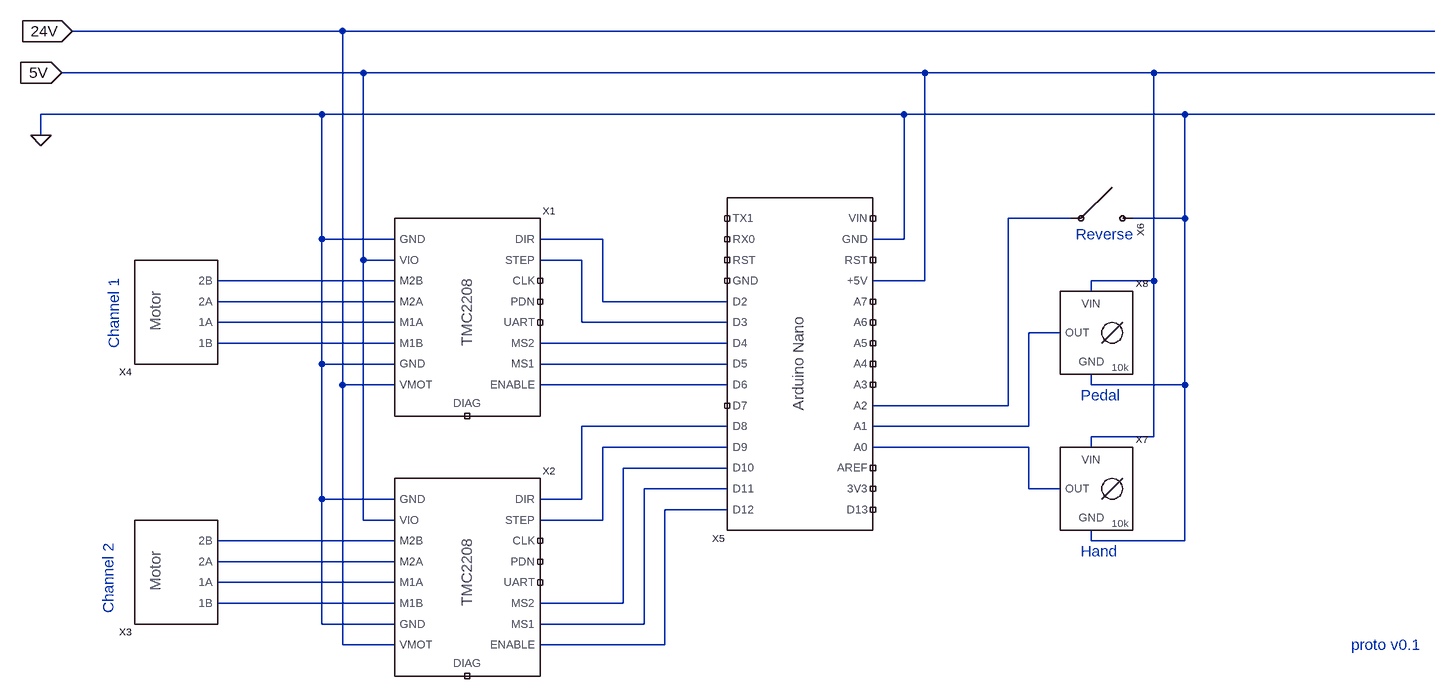
[diagram p0: schematic dual_stepper.asc]
dual_stepper.asc, the LTspice schematic file:
Version 4
SHEET 1 1844 740
WIRE -304 -384 -720 -384
WIRE 1376 -384 -304 -384
WIRE -272 -320 -736 -320
WIRE 592 -320 -272 -320
WIRE 944 -320 592 -320
WIRE 1376 -320 944 -320
WIRE -336 -256 -768 -256
WIRE 560 -256 -336 -256
WIRE 992 -256 560 -256
WIRE 1376 -256 992 -256
WIRE -768 -224 -768 -256
WIRE 816 -96 720 -96
WIRE 992 -96 992 -256
WIRE 992 -96 912 -96
WIRE -336 -64 -336 -256
WIRE -224 -64 -336 -64
WIRE 96 -64 0 -64
WIRE 560 -64 560 -256
WIRE 560 -64 512 -64
WIRE -272 -32 -272 -320
WIRE -224 -32 -272 -32
WIRE 64 -32 0 -32
WIRE -224 0 -496 0
WIRE 592 0 592 -320
WIRE 592 0 512 0
WIRE 944 0 944 -320
WIRE 944 0 848 0
WIRE 848 16 848 0
WIRE -224 32 -496 32
WIRE 96 32 96 -64
WIRE 288 32 96 32
WIRE -224 64 -496 64
WIRE 64 64 64 -32
WIRE 288 64 64 64
WIRE 800 80 752 80
WIRE -224 96 -496 96
WIRE 288 96 0 96
WIRE -336 128 -336 -64
WIRE -224 128 -336 128
WIRE 288 128 0 128
WIRE -304 160 -304 -384
WIRE -224 160 -304 160
WIRE 288 160 0 160
WIRE 848 160 848 144
WIRE 992 160 992 -96
WIRE 992 160 848 160
WIRE 720 192 720 -96
WIRE 720 192 512 192
WIRE 288 224 64 224
WIRE 752 224 752 80
WIRE 752 224 512 224
WIRE 944 240 944 0
WIRE 944 240 848 240
WIRE 288 256 96 256
WIRE 752 256 512 256
WIRE 848 256 848 240
WIRE 288 288 128 288
WIRE 288 320 160 320
WIRE 752 320 752 256
WIRE 800 320 752 320
WIRE -336 336 -336 128
WIRE -224 336 -336 336
WIRE 64 336 64 224
WIRE 64 336 0 336
WIRE 288 352 192 352
WIRE -272 368 -272 -32
WIRE -224 368 -272 368
WIRE 96 368 96 256
WIRE 96 368 0 368
WIRE -224 400 -496 400
WIRE 848 400 848 384
WIRE 992 400 992 160
WIRE 992 400 848 400
WIRE -224 432 -496 432
WIRE -224 464 -496 464
WIRE -224 496 -496 496
WIRE 128 496 128 288
WIRE 128 496 0 496
WIRE -336 528 -336 336
WIRE -224 528 -336 528
WIRE 160 528 160 320
WIRE 160 528 0 528
WIRE -304 560 -304 160
WIRE -224 560 -304 560
WIRE 192 560 192 352
WIRE 192 560 0 560
FLAG -768 -224 0
FLAG -720 -384 24V
IOPIN -720 -384 In
FLAG -736 -320 5V
IOPIN -736 -320 In
SYMBOL TMC2208 -240 -80 R0
SYMATTR InstName X1
SYMBOL TMC2208 -240 320 R0
SYMATTR InstName X2
SYMBOL motor -576 448 R180
SYMATTR InstName X3
SYMBOL motor -576 48 R180
SYMATTR InstName X4
SYMBOL arduino_nano 512 352 R180
SYMATTR InstName X5
SYMBOL switch 864 -96 R90
SYMATTR InstName X6
SYMBOL potentiometer 848 336 R0
SYMATTR InstName X7
SYMBOL potentiometer 848 96 R0
SYMATTR InstName X8
TEXT -656 104 VLeft 2 ;Channel 1
TEXT -664 512 VLeft 2 ;Channel 2
TEXT 1248 560 Left 2 ;proto v0.1
TEXT 824 -72 Left 2 ;Reverse
TEXT 832 176 Left 2 ;Pedal
TEXT 832 416 Left 2 ;Hand

The netlist it stands for:
* dual_stepper.asc
XX1 0 5V N004 N005 N006 N008 0 24V N002 N003 NC_01 NC_02 NC_03 N009 N010 N011 NC_04 TMC2208  ; pins GND VIO M2B M2A M1A M1B GND VMOT DIR STEP CLK PDN UART MS2 MS1 ENABLE DIAG
XX2 0 5V N018 N019 N020 N021 0 24V N012 N013 NC_05 NC_06 NC_07 N015 N016 N017 NC_08 TMC2208  ; pins GND VIO M2B M2A M1A M1B GND VMOT DIR STEP CLK PDN UART MS2 MS1 ENABLE DIAG
XX3 N021 N020 N019 N018 motor  ; pins 1B 1A 2A 2B
XX4 N008 N006 N005 N004 motor  ; pins 1B 1A 2A 2B
XX5 NC_09 NC_10 NC_11 N014 N007 N001 NC_12 NC_13 NC_14 NC_15 NC_16 5V NC_17 0 NC_18 N017 N016 N015 N013 N012 NC_19 N011 N010 N009 N003 N002 NC_20 NC_21 NC_22 NC_23 arduino_nano  ; pins D13 3V3 AREF A0 A1 A2 A3 A4 A5 A6 A7 +5V RST GND VIN D12 D11 D10 D9 D8 D7 D6 D5 D4 D3 D2 GND RX0 TX1 RST
XX6 0 N001 switch  ; pins A B
XX7 0 5V N014 potentiometer  ; pins GND VIN OUT
XX8 0 5V N007 potentiometer  ; pins GND VIN OUT
* Channel 1
* Channel 2
* proto v0.1
* Reverse
* Pedal
* Hand
.backanno
.end